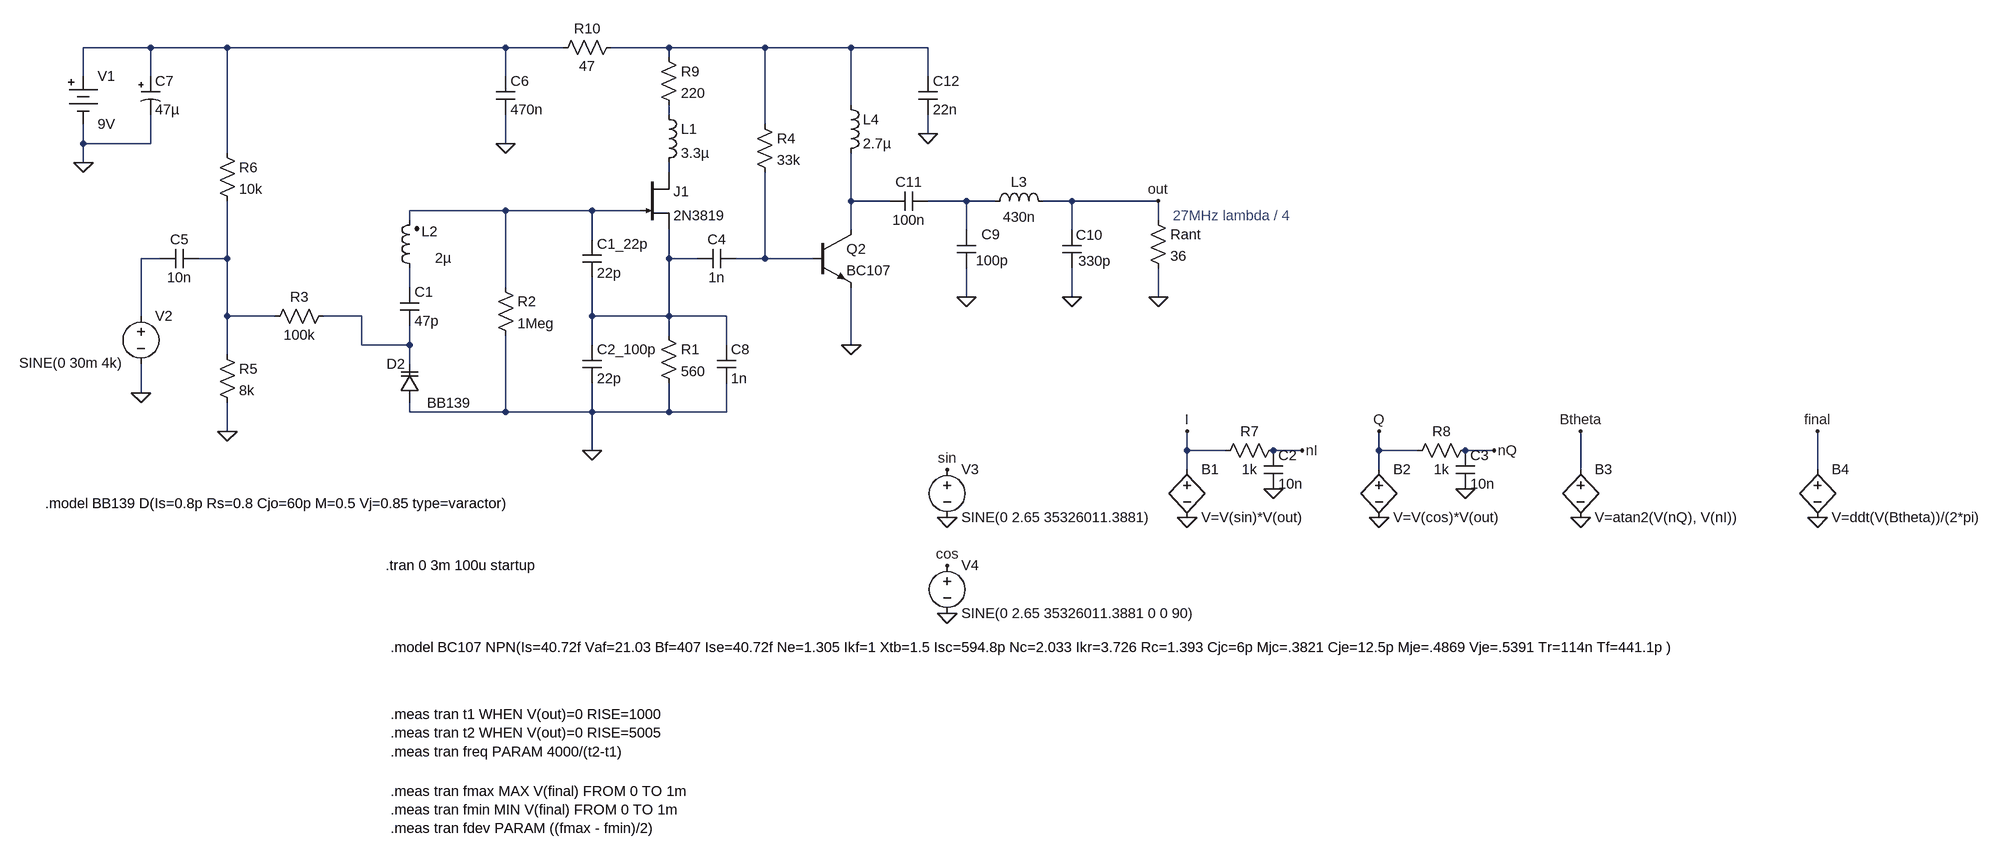
[diagram p0: schematic mini-fm-transmitter-clapp-2.asc]
mini-fm-transmitter-clapp-2.asc, the LTspice schematic file:
Version 4.1
SHEET 1 1244 716
WIRE -1856 -672 -1968 -672
WIRE -1728 -672 -1856 -672
WIRE -1264 -672 -1728 -672
WIRE -1168 -672 -1264 -672
WIRE -992 -672 -1088 -672
WIRE -832 -672 -992 -672
WIRE -688 -672 -832 -672
WIRE -560 -672 -688 -672
WIRE -992 -656 -992 -672
WIRE -1968 -624 -1968 -672
WIRE -1856 -624 -1856 -672
WIRE -1264 -624 -1264 -672
WIRE -560 -624 -560 -672
WIRE -688 -576 -688 -672
WIRE -992 -560 -992 -576
WIRE -832 -544 -832 -672
WIRE -560 -528 -560 -560
WIRE -1968 -512 -1968 -544
WIRE -1856 -512 -1856 -560
WIRE -1856 -512 -1968 -512
WIRE -1264 -512 -1264 -560
WIRE -1728 -496 -1728 -672
WIRE -1968 -480 -1968 -512
WIRE -992 -464 -992 -480
WIRE -688 -416 -688 -496
WIRE -624 -416 -688 -416
WIRE -496 -416 -560 -416
WIRE -448 -416 -496 -416
WIRE -320 -416 -368 -416
WIRE -176 -416 -320 -416
WIRE -1264 -400 -1424 -400
WIRE -1120 -400 -1264 -400
WIRE -1040 -400 -1120 -400
WIRE -1424 -384 -1424 -400
WIRE -176 -384 -176 -416
WIRE -688 -368 -688 -416
WIRE -496 -368 -496 -416
WIRE -320 -368 -320 -416
WIRE -1120 -352 -1120 -400
WIRE -1840 -320 -1872 -320
WIRE -1728 -320 -1728 -416
WIRE -1728 -320 -1776 -320
WIRE -992 -320 -992 -368
WIRE -944 -320 -992 -320
WIRE -832 -320 -832 -464
WIRE -832 -320 -880 -320
WIRE -752 -320 -832 -320
WIRE -1424 -272 -1424 -304
WIRE -1264 -272 -1264 -400
WIRE -496 -256 -496 -304
WIRE -320 -256 -320 -304
WIRE -176 -256 -176 -304
WIRE -1872 -224 -1872 -320
WIRE -1728 -224 -1728 -320
WIRE -1648 -224 -1728 -224
WIRE -1504 -224 -1568 -224
WIRE -1120 -224 -1120 -288
WIRE -992 -224 -992 -320
WIRE -992 -224 -1120 -224
WIRE -896 -224 -992 -224
WIRE -992 -192 -992 -224
WIRE -1504 -176 -1504 -224
WIRE -1424 -176 -1424 -208
WIRE -1424 -176 -1504 -176
WIRE -1120 -176 -1120 -224
WIRE -896 -176 -896 -224
WIRE -688 -176 -688 -272
WIRE -1728 -160 -1728 -224
WIRE -1424 -144 -1424 -176
WIRE -1872 -96 -1872 -144
WIRE -1424 -64 -1424 -80
WIRE -1264 -64 -1264 -192
WIRE -1264 -64 -1424 -64
WIRE -1120 -64 -1120 -112
WIRE -1120 -64 -1264 -64
WIRE -992 -64 -992 -112
WIRE -992 -64 -1120 -64
WIRE -896 -64 -896 -112
WIRE -896 -64 -992 -64
WIRE -1728 -32 -1728 -80
WIRE -1120 0 -1120 -64
WIRE -128 0 -128 -32
WIRE -64 0 -128 0
WIRE 64 0 16 0
WIRE 192 0 192 -32
WIRE 256 0 192 0
WIRE 384 0 336 0
WIRE -128 32 -128 0
WIRE 192 32 192 0
WIRE 528 32 528 -32
WIRE 928 32 928 -32
FLAG -1120 0 0
FLAG -1968 -480 0
FLAG -1264 -512 0
FLAG -688 -176 0
FLAG -496 -256 0
FLAG -320 -256 0
FLAG -176 -256 0
FLAG -560 -528 0
FLAG -176 -416 out
FLAG -1728 -32 0
FLAG -1872 -96 0
FLAG -528 32 sin
FLAG -528 112 0
FLAG -128 112 0
FLAG -128 -32 I
FLAG -528 192 cos
FLAG -528 272 0
FLAG 192 112 0
FLAG 192 -32 Q
FLAG 528 112 0
FLAG 528 -32 Btheta
FLAG 928 112 0
FLAG 928 -32 final
FLAG 16 64 0
FLAG 336 64 0
FLAG 384 0 nQ
FLAG 64 0 nI
SYMBOL cap -1136 -352 R0
SYMATTR InstName C1_22p
SYMATTR Value 22p
SYMBOL cap -1136 -176 R0
SYMATTR InstName C2_100p
SYMATTR Value 22p
SYMBOL res -1008 -208 R0
SYMATTR InstName R1
SYMATTR Value 560
SYMBOL Misc\\battery -1968 -640 R0
SYMATTR InstName V1
SYMATTR Value 9V
SYMBOL ind2 -1408 -288 R180
WINDOW 0 -31 77 Left 2
WINDOW 3 -53 33 Left 2
SYMATTR InstName L2
SYMATTR Value 2µ
SYMATTR SpiceLine Rser=0.1
SYMBOL njf -1040 -464 R0
SYMATTR InstName J1
SYMATTR Value 2N3819
SYMBOL res -1280 -288 R0
SYMATTR InstName R2
SYMATTR Value 1Meg
SYMBOL cap -944 -304 R270
WINDOW 0 32 32 VTop 2
WINDOW 3 0 32 VBottom 2
SYMATTR InstName C4
SYMATTR Value 1n
SYMBOL varactor -1408 -80 R180
WINDOW 0 24 64 Left 2
WINDOW 3 -85 -1 Left 2
SYMATTR InstName D2
SYMATTR Value BB139
SYMATTR Type diode
SYMBOL cap -1280 -624 R0
SYMATTR InstName C6
SYMATTR Value 470n
SYMBOL res -1184 -656 R270
WINDOW 0 32 56 VTop 2
WINDOW 3 0 56 VBottom 2
SYMATTR InstName R10
SYMATTR Value 47
SYMBOL polcap -1872 -624 R0
SYMATTR InstName C7
SYMATTR Value 47µ
SYMBOL ind -1008 -576 R0
SYMATTR InstName L1
SYMATTR Value 3.3µ
SYMATTR SpiceLine Rser=4
SYMBOL cap -480 -304 R180
WINDOW 0 -40 56 Left 2
WINDOW 3 -54 13 Left 2
SYMATTR InstName C9
SYMATTR Value 100p
SYMBOL cap -304 -304 R180
WINDOW 0 -35 55 Left 2
WINDOW 3 -49 12 Left 2
SYMATTR InstName C10
SYMATTR Value 330p
SYMBOL ind -464 -400 R270
WINDOW 0 32 56 VTop 2
WINDOW 3 5 56 VBottom 2
SYMATTR InstName L3
SYMATTR Value 430n
SYMATTR SpiceLine Rser=1m
SYMBOL res -192 -400 R0
SYMATTR InstName Rant
SYMATTR Value 36
SYMBOL ind -704 -592 R0
SYMATTR InstName L4
SYMATTR Value 2.7µ
SYMATTR SpiceLine Rser=10m
SYMBOL cap -560 -432 R90
WINDOW 0 0 32 VBottom 2
WINDOW 3 32 32 VTop 2
SYMATTR InstName C11
SYMATTR Value 100n
SYMBOL npn -752 -368 R0
SYMATTR InstName Q2
SYMATTR Value BC107
SYMBOL res -848 -560 R0
SYMATTR InstName R4
SYMATTR Value 33k
SYMBOL cap -576 -624 R0
SYMATTR InstName C12
SYMATTR Value 22n
SYMBOL res -1664 -208 R270
WINDOW 0 32 56 VTop 2
WINDOW 3 0 56 VBottom 2
SYMATTR InstName R3
SYMATTR Value 100k
SYMBOL res -1744 -512 R0
SYMATTR InstName R6
SYMATTR Value 10k
SYMBOL res -1744 -176 R0
SYMATTR InstName R5
SYMATTR Value 8k
SYMBOL cap -1440 -272 R0
SYMATTR InstName C1
SYMATTR Value 47p
SYMBOL voltage -1872 -240 R0
WINDOW 3 -203 94 Left 2
WINDOW 123 0 0 Left 0
WINDOW 39 0 0 Left 0
SYMATTR Value SINE(0 30m 4k)
SYMATTR InstName V2
SYMBOL voltage -528 16 R0
WINDOW 123 0 0 Left 0
WINDOW 39 0 0 Left 0
SYMATTR InstName V3
SYMATTR Value SINE(0 2.65 35326011.3881)
SYMBOL bv -128 16 R0
SYMATTR InstName B1
SYMATTR Value V=V(sin)*V(out)
SYMBOL voltage -528 176 R0
WINDOW 123 0 0 Left 0
WINDOW 39 0 0 Left 0
SYMATTR InstName V4
SYMATTR Value SINE(0 2.65 35326011.3881 0 0 90)
SYMBOL bv 192 16 R0
SYMATTR InstName B2
SYMATTR Value V=V(cos)*V(out)
SYMBOL bv 528 16 R0
SYMATTR InstName B3
SYMATTR Value V=atan2(V(nQ), V(nI))
SYMBOL bv 928 16 R0
SYMATTR InstName B4
SYMATTR Value V=ddt(V(Btheta))/(2*pi)
SYMBOL res 32 -16 R90
WINDOW 0 0 56 VBottom 2
WINDOW 3 32 56 VTop 2
SYMATTR InstName R7
SYMATTR Value 1k
SYMBOL cap 0 0 R0
SYMATTR InstName C2
SYMATTR Value 10n
SYMBOL res 352 -16 R90
WINDOW 0 0 56 VBottom 2
WINDOW 3 32 56 VTop 2
SYMATTR InstName R8
SYMATTR Value 1k
SYMBOL cap 320 0 R0
SYMATTR InstName C3
SYMATTR Value 10n
SYMBOL cap -1776 -336 R90
WINDOW 0 0 32 VBottom 2
WINDOW 3 32 32 VTop 2
SYMATTR InstName C5
SYMATTR Value 10n
SYMBOL cap -912 -176 R0
SYMATTR InstName C8
SYMATTR Value 1n
SYMBOL res -1008 -672 R0
SYMATTR InstName R9
SYMATTR Value 220
TEXT -1464 192 Left 2 !.tran 0 3m 100u startup
TEXT -152 -392 Left 2 ;27MHz lambda / 4
TEXT -1456 328 Left 2 !.model BC107 NPN(Is=40.72f Vaf=21.03 Bf=407 Ise=40.72f Ne=1.305 Ikf=1 Xtb=1.5 Isc=594.8p Nc=2.033 Ikr=3.726 Rc=1.393 Cjc=6p Mjc=.3821 Cje=12.5p Mje=.4869 Vje=.5391 Tr=114n Tf=441.1p )
TEXT -2032 88 Left 2 !.model BB139 D(Is=0.8p Rs=0.8 Cjo=60p M=0.5 Vj=0.85 type=varactor)
TEXT -1456 440 Left 2 !.meas tran t1 WHEN V(out)=0 RISE=1000\n.meas tran t2 WHEN V(out)=0 RISE=5005\n.meas tran freq PARAM 4000/(t2-t1)
TEXT -1456 568 Left 2 !.meas tran fmax MAX V(final) FROM 0 TO 1m\n.meas tran fmin MIN V(final) FROM 0 TO 1m\n.meas tran fdev PARAM ((fmax - fmin)/2)

The netlist it stands for:
* mini-fm-transmitter-clapp-2.asc
C1_22p N007 N010 22p
C2_100p N010 0 22p
R1 N010 0 560
V1 N001 0 9V
L2 N012 N007 2µ Rser=0.1
J1 N004 N007 N010 2N3819
R2 N007 0 1Meg
C4 N010 N011 1n
D2 0 N013 BB139
C6 N001 0 470n
R10 N001 N002 47
C7 N001 0 47µ
L1 N003 N004 3.3µ Rser=4
C9 0 N006 100p
C10 0 out 330p
L3 N006 out 430n Rser=1m
Rant out 0 36
L4 N002 N005 2.7µ Rser=10m
C11 N006 N005 100n
Q2 N005 N011 0 0 BC107
R4 N002 N011 33k
C12 N002 0 22n
R3 N009 N013 100k
R6 N001 N009 10k
R5 N009 0 8k
C1 N012 N013 47p
V2 N008 0 SINE(0 30m 4k)
V3 sin 0 SINE(0 2.65 35326011.3881)
B1 I 0 V=V(sin)*V(out)
V4 cos 0 SINE(0 2.65 35326011.3881 0 0 90)
B2 Q 0 V=V(cos)*V(out)
B3 Btheta 0 V=atan2(V(nQ), V(nI))
B4 final 0 V=ddt(V(Btheta))/(2*pi)
R7 nI I 1k
C2 nI 0 10n
R8 nQ Q 1k
C3 nQ 0 10n
C5 N009 N008 10n
C8 N010 0 1n
R9 N002 N003 220
.model D D
.lib standard.dio
.model NPN NPN
.model PNP PNP
.lib standard.bjt
.model NJF NJF
.model PJF PJF
.lib standard.jft
.tran 0 3m 100u startup
* 27MHz lambda / 4
.model BC107 NPN(Is=40.72f Vaf=21.03 Bf=407 Ise=40.72f Ne=1.305 Ikf=1 Xtb=1.5 Isc=594.8p Nc=2.033 Ikr=3.726 Rc=1.393 Cjc=6p Mjc=.3821 Cje=12.5p Mje=.4869 Vje=.5391 Tr=114n Tf=441.1p )
.model BB139 D(Is=0.8p Rs=0.8 Cjo=60p M=0.5 Vj=0.85 type=varactor)
.meas tran t1 WHEN V(out)=0 RISE=1000
.meas tran t2 WHEN V(out)=0 RISE=5005
.meas tran freq PARAM 4000/(t2-t1)
.meas tran fmax MAX V(final) FROM 0 TO 1m
.meas tran fmin MIN V(final) FROM 0 TO 1m
.meas tran fdev PARAM ((fmax - fmin)/2)
.backanno
.end